# Altium schematic sheet IR_robottino_tracking_schematics.SchDoc
size A4
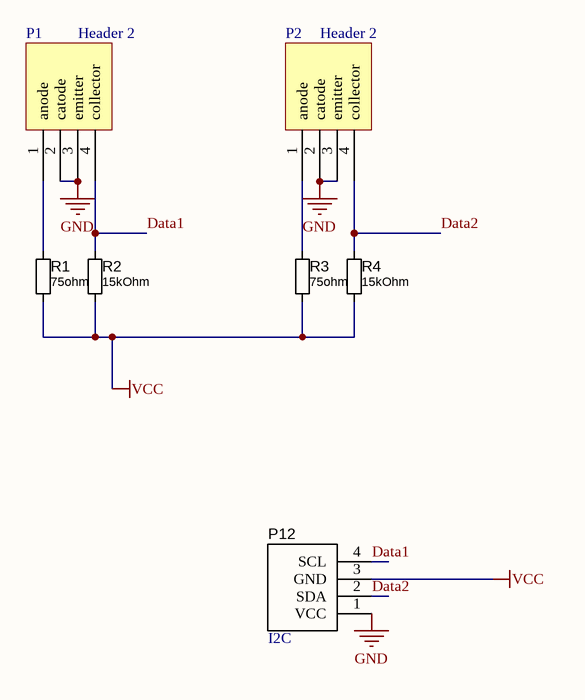
[diagram p0: IR_robottino_tracking_schematics.SchDoc]

## Parts
P1  Header 2  [TCRT 1000]
P2  Header 2  [TCRT 1000]
P12  I2C  [TYCO/215079-4]
R1  75ohm  [R/1206]
R2  15kOhm  [R/0805]
R3  75ohm  [R/1206]
R4  15kOhm  [R/0805]

## Nets
GND: P1.2(catode) P1.3(emitter) P2.2(catode) P2.3(emitter) P12.1(VCC)
VCC: P12.3(GND) R1.2 R2.1 R3.1 R4.1
Data1: P1.4(collector) P12.4(SCL) R2.2
Data2: P2.4(collector) P12.2(SDA) R4.2
NetP1_1: P1.1(anode) R1.1
NetP2_1: P2.1(anode) R3.2

## Library data of the parts
P1 P2 = TCRT 1000: Header, 2-Pin; LatestRevisionDate: 17-Jul-2002; LatestRevisionNote: Re-released for DXP Platform.; Publisher: Altium Limited
P12 = Micromatch-I2C: Micromatch I2C Connector
R1-R4 = R: Resistor; Published: 8-Jun-2000; LatestRevisionDate: 17-Jul-2002; LatestRevisionNote: Re-released for DXP Platform.; PackageReference: AXIAL-0.4; Publisher: Altium Limited
  R1 R3: Value: 75ohm
  R2 R4: Value: 15kOhm